# Altium project FMC_ADC_250M_16B_4ch.PrjPCB (part 2 of 4)

## Sheet ADC.SchDoc
size A3
Used 4 times, as channels U_ADC, U_ADC, U_ADC, U_ADC. Parts and nets are listed once, with the designators drawn on the sheet.
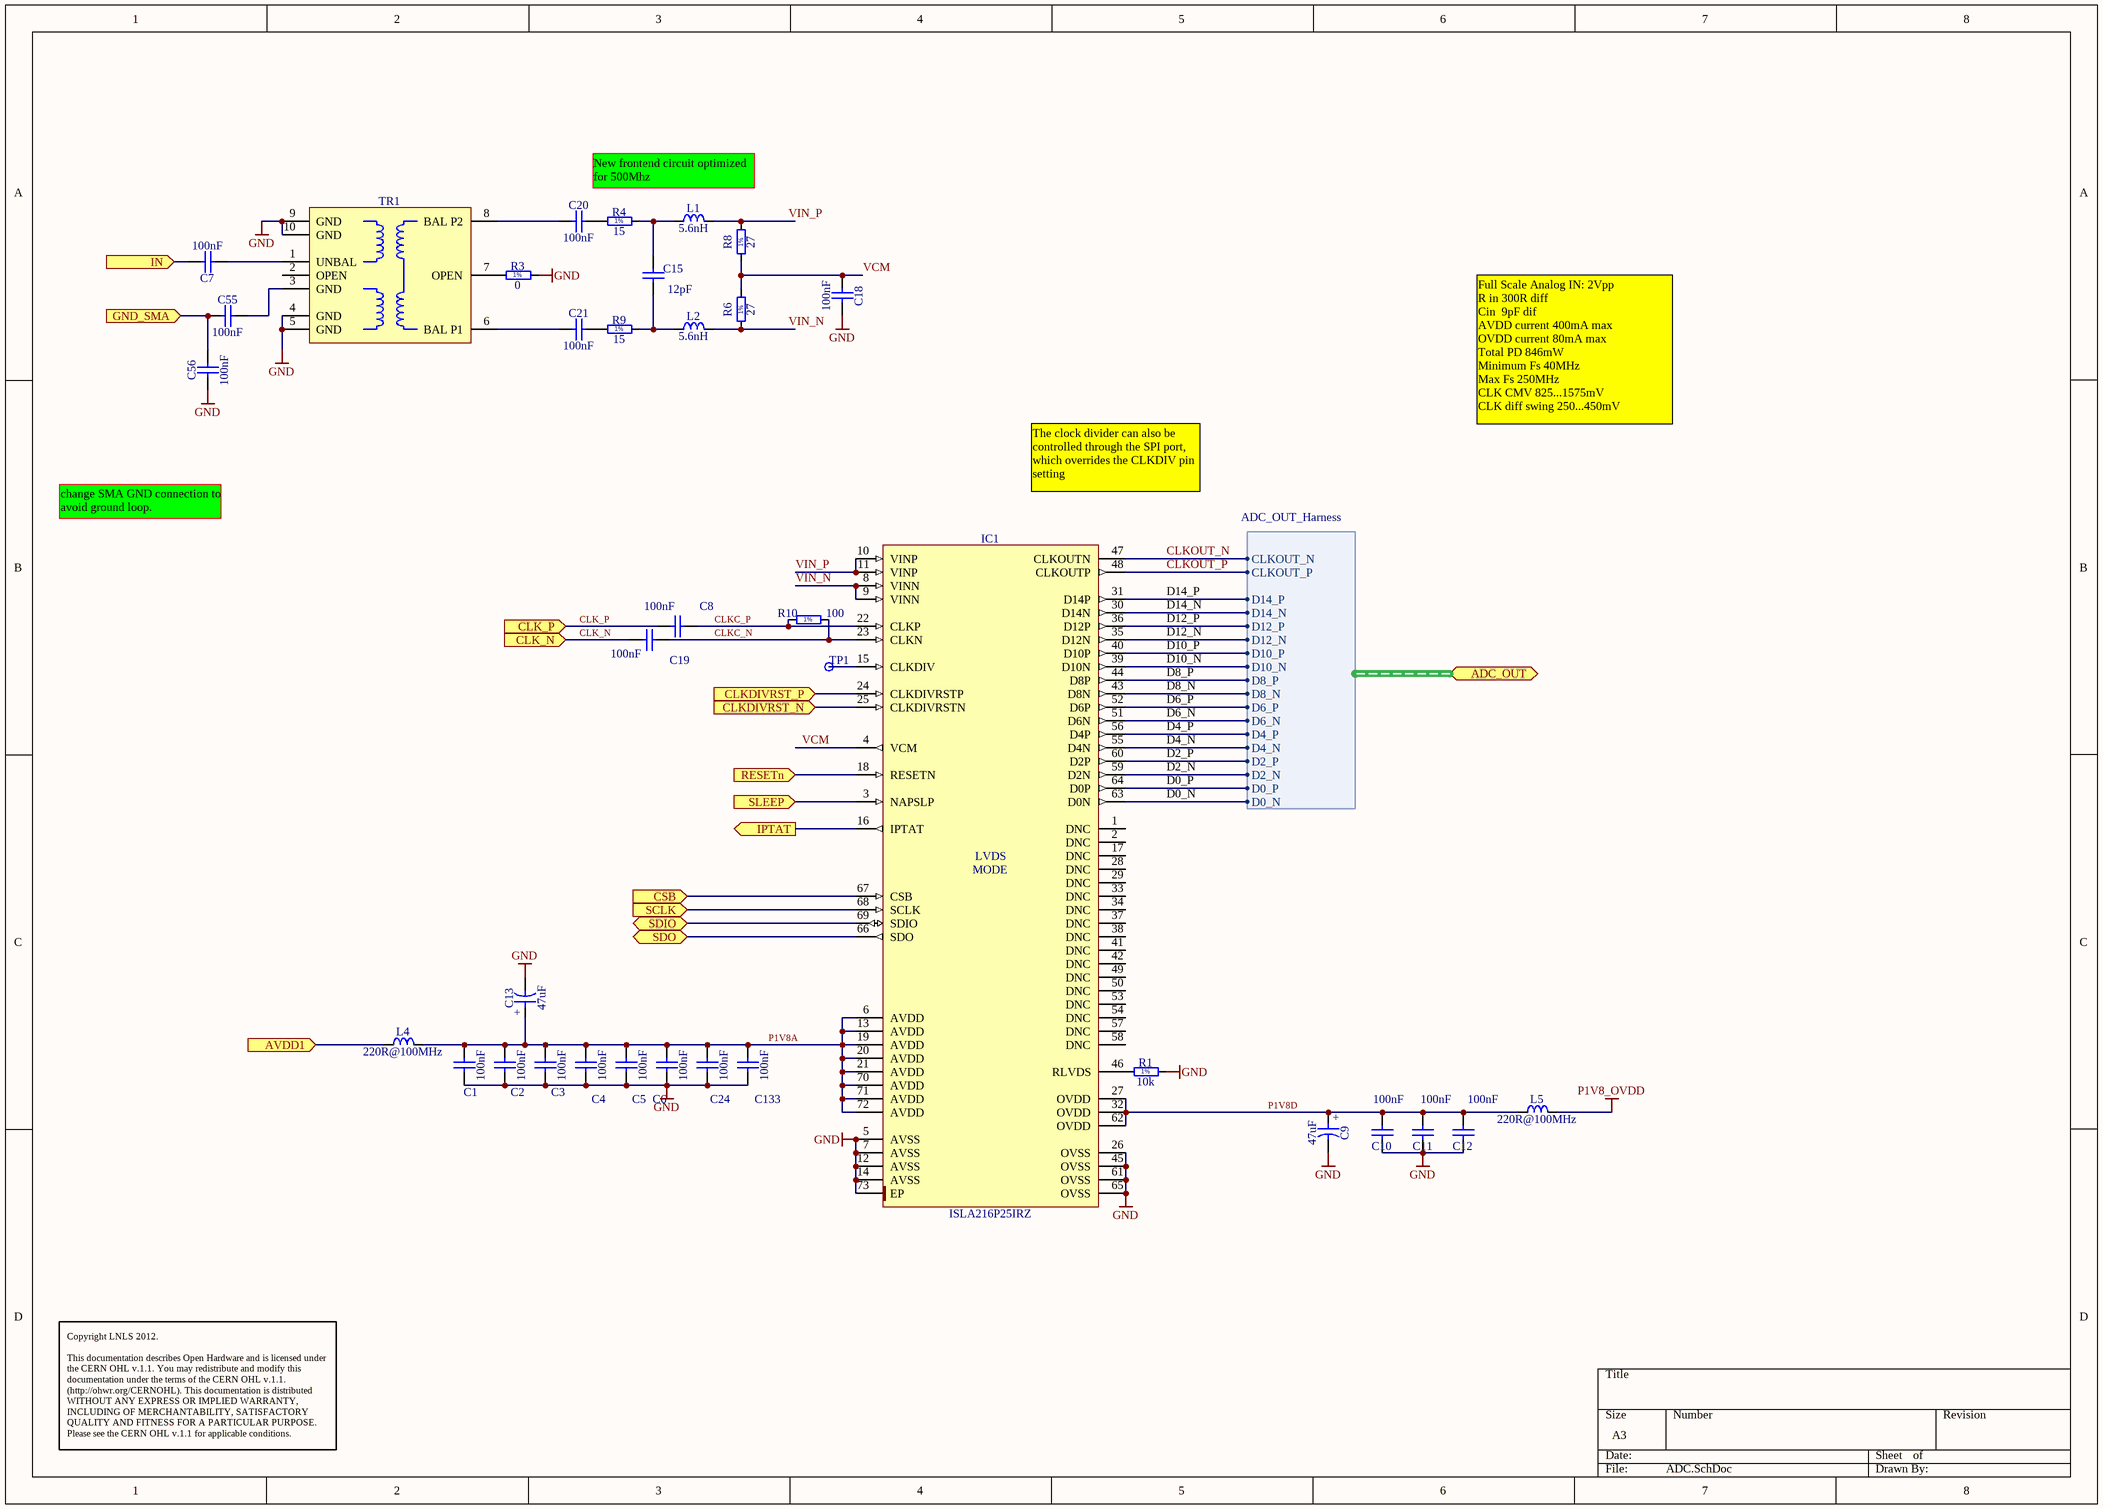
[diagram p3: ADC.SchDoc]

### Parts
C1  100nF  [CAPC0603X33N]
C2  100nF  [CAPC0603X33N]
C3  100nF  [CAPC0603X33N]
C4  100nF  [CAPC0603X33N]
C5  100nF  [CAPC0603X33N]
C6  100nF  [CAPC0603X33N]
C7  100nF  [CAPC0603X33N]
C8  100nF  [CAPC0603X33N]
C9  47uF  [CAPMP3528X210N]
C10  100nF  [CAPC0603X33N]
C11  100nF  [CAPC0603X33N]
C12  100nF  [CAPC0603X33N]
C13  47uF  [CAPMP3528X210N]
C15  12pF  [CAPC2012X135N]
C18  100nF  [CAPC0603X33N]
C19  100nF  [CAPC0603X33N]
C20  100nF  [CAPC0603X33N]
C21  100nF  [CAPC0603X33N]
C24  100nF  [CAPC0603X33N]
C55  100nF  [CAPC0603X33N]
C56  100nF  [CAPC0603X33N]
C133  100nF  [CAPC0603X33N]
IC1  ISLA216P25IRZ  [INTERSIL_L72.10x10E]
L1  5.6nH  [INDC1005X55N]
L2  5.6nH  [INDC1005X55N]
L4  220R@100MHz  [INDC2012X105N]
L5  220R@100MHz  [INDC2012X105N]
R1  10k  [RESC1005X40N]
R3  0  [RESC1005X40N]
R4  15  [RESC1005X40N]
R6  27  [RESC1005X40N]
R8  27  [RESC1005X40N]
R9  15  [RESC1005X40N]
R10  100  [RESC1005X40N]
TP1  (no value)  [TPR120]
TR1  (no value)  [XFMR_ANAREN_BD0205F5050A00]

### Ports
ADC_OUT (harness ADC_OUT_Harness), AVDD1 (in), CLK_N (in), CLK_P (in), CLKDIVRST_N (in), CLKDIVRST_P (in), CSB (in), GND_SMA (in), IN (in), IPTAT (out), RESETn (in), SCLK (in), SDIO (bidir), SDO, SLEEP (in)

### Harnesses
ADC_OUT_Harness: D14_P, D14_N, D12_P, D12_N, D10_P, D10_N, D8_P, D8_N, D6_P, D6_N, D4_P, D4_N, D2_P, D2_N, D0_P, D0_N, CLKOUT_N, CLKOUT_P

### Nets
GND: C1.1 C2.1 C3.1 C4.1 C5.1 C6.1 C9.2 C10.1 C11.1 C12.1 C13.2 C18.2 C24.1 C56.1 C133.1 IC1.5(AVSS) IC1.7(AVSS) IC1.12(AVSS) IC1.14(AVSS) IC1.26(OVSS) IC1.45(OVSS) IC1.61(OVSS) IC1.65(OVSS) IC1.73(EP) R1.2 R3.2 TR1.4(GND) TR1.5(GND) TR1.9(GND) TR1.10(GND)
P1V8_OVDD: L5.2
AVDD1: L4.1 ; port AVDD1
CLK_N: C19.1 ; port CLK_N
CLK_P: C8.1 ; port CLK_P
CLKC_N: C19.2 IC1.23(CLKN) R10.2
CLKC_P: C8.2 IC1.22(CLKP) R10.1
CLKDIVRST_N: IC1.25(CLKDIVRSTN) ; port CLKDIVRST_N
CLKDIVRST_P: IC1.24(CLKDIVRSTP) ; port CLKDIVRST_P
CLKOUT_N: IC1.47(CLKOUTN) ; port ADC_OUT.CLKOUT_N
CLKOUT_P: IC1.48(CLKOUTP) ; port ADC_OUT.CLKOUT_P
CSB: IC1.67(CSB) ; port CSB
D0_N: IC1.63(D0N) ; port ADC_OUT.D0_N
D0_P: IC1.64(D0P) ; port ADC_OUT.D0_P
D2_N: IC1.59(D2N) ; port ADC_OUT.D2_N
D2_P: IC1.60(D2P) ; port ADC_OUT.D2_P
D4_N: IC1.55(D4N) ; port ADC_OUT.D4_N
D4_P: IC1.56(D4P) ; port ADC_OUT.D4_P
D6_N: IC1.51(D6N) ; port ADC_OUT.D6_N
D6_P: IC1.52(D6P) ; port ADC_OUT.D6_P
D8_N: IC1.43(D8N) ; port ADC_OUT.D8_N
D8_P: IC1.44(D8P) ; port ADC_OUT.D8_P
D10_N: IC1.39(D10N) ; port ADC_OUT.D10_N
D10_P: IC1.40(D10P) ; port ADC_OUT.D10_P
D12_N: IC1.35(D12N) ; port ADC_OUT.D12_N
D12_P: IC1.36(D12P) ; port ADC_OUT.D12_P
D14_N: IC1.30(D14N) ; port ADC_OUT.D14_N
D14_P: IC1.31(D14P) ; port ADC_OUT.D14_P
GND_SMA: C55.1 C56.2 ; port GND_SMA
IN: C7.2 ; port IN
IPTAT: IC1.16(IPTAT) ; port IPTAT
P1V8A: C1.2 C2.2 C3.2 C4.2 C5.2 C6.2 C13.1 C24.2 C133.2 IC1.6(AVDD) IC1.13(AVDD) IC1.19(AVDD) IC1.20(AVDD) IC1.21(AVDD) IC1.70(AVDD) IC1.71(AVDD) IC1.72(AVDD) L4.2
P1V8D: C9.1 C10.2 C11.2 C12.2 IC1.27(OVDD) IC1.32(OVDD) IC1.62(OVDD) L5.1
RESETn: IC1.18(RESETN) ; port RESETn
SCLK: IC1.68(SCLK) ; port SCLK
SDIO: IC1.69(SDIO) ; port SDIO
SDO: IC1.66(SDO) ; port SDO
SLEEP: IC1.3(NAPSLP) ; port SLEEP
VCM: C18.1 IC1.4(VCM) R6.2 R8.1
VIN_N: IC1.8(VINN) IC1.9(VINN) L2.2 R6.1
VIN_P: IC1.10(VINP) IC1.11(VINP) L1.2 R8.2
NetC7_1: C7.1 TR1.1(UNBAL)
NetC15_1: C15.1 L2.1 R9.2
NetC15_2: C15.2 L1.1 R4.2
NetC20_1: C20.1 TR1.8(BAL_P2)
NetC20_2: C20.2 R4.1
NetC21_1: C21.1 TR1.6(BAL_P1)
NetC21_2: C21.2 R9.1
NetC55_2: C55.2 TR1.3(GND)
NetIC1_15: IC1.15(CLKDIV) TP1.1
NetIC1_46: IC1.46(RLVDS) R1.1
NetR3_1: R3.1 TR1.7(OPEN)

Not connected (* = marked no-connect by the designer): IC1 1(DNC) 2(DNC) 17(DNC) 28(DNC) 29(DNC) 33(DNC) 34(DNC) 37(DNC) 38(DNC) 41(DNC) 42(DNC) 49(DNC) 50(DNC) 53(DNC) 54(DNC) 57(DNC) 58(DNC); TR1 2(OPEN)

### Channels
U_ADC: designators end in A; ports AVDD1=P1V8_AVDD1 CLK_N=ADC1_CLK_N CLK_P=ADC1_CLK_P CLKDIVRST_N=CLKDIVRST_N CLKDIVRST_P=CLKDIVRST_P CSB=ADC_BUF_CSB0 GND_SMA=NetC55A_1 IN=IN1 IPTAT=IPTAT1 RESETn=ADC_BUF_RESETn SCLK=ADC_BUF_SCLK SDIO=ADC_BUF_SDI SDO=ADC_BUF_SDO SLEEP=ADC_BUF_SLEEP
U_ADC: designators end in B; ports AVDD1=P1V8_AVDD1 CLK_N=ADC2_CLK_N CLK_P=ADC2_CLK_P CLKDIVRST_N=CLKDIVRST_N CLKDIVRST_P=CLKDIVRST_P CSB=ADC_BUF_CSB1 GND_SMA=NetC55B_1 IN=IN2 IPTAT=IPTAT2 RESETn=ADC_BUF_RESETn SCLK=ADC_BUF_SCLK SDIO=ADC_BUF_SDI SDO=ADC_BUF_SDO SLEEP=ADC_BUF_SLEEP
U_ADC: designators end in C; ports AVDD1=P1V8_AVDD2 CLK_N=ADC3_CLK_N CLK_P=ADC3_CLK_P CLKDIVRST_N=CLKDIVRST_N CLKDIVRST_P=CLKDIVRST_P CSB=ADC_BUF_CSB2 GND_SMA=NetC55C_1 IN=IN3 IPTAT=IPTAT3 RESETn=ADC_BUF_RESETn SCLK=ADC_BUF_SCLK SDIO=ADC_BUF_SDI SDO=ADC_BUF_SDO SLEEP=ADC_BUF_SLEEP
U_ADC: designators end in D; ports AVDD1=P1V8_AVDD2 CLK_N=ADC4_CLK_N CLK_P=ADC4_CLK_P CLKDIVRST_N=CLKDIVRST_N CLKDIVRST_P=CLKDIVRST_P CSB=ADC_BUF_CSB3 GND_SMA=NetC55D_1 IN=IN4 IPTAT=IPTAT4 RESETn=ADC_BUF_RESETn SCLK=ADC_BUF_SCLK SDIO=ADC_BUF_SDI SDO=ADC_BUF_SDO SLEEP=ADC_BUF_SLEEP

### Notes on the sheet
- New frontend circuit optimized for 500Mhz
- Full Scale Analog IN:	2Vpp
  R in	300R diff
  Cin 	9pF dif
  AVDD current 400mA max
  OVDD current 80mA max
  Total PD 846mW
  Minimum Fs 40MHz
  Max Fs 250MHz
  CLK CMV 825...1575mV
  CLK diff swing 250...450mV
- change SMA GND connection to avoid ground loop.
- The clock divider can also be controlled through the SPI port,
  which overrides the CLKDIV pin setting
- Copyright LNLS 2012.
  This documentation describes Open Hardware and is licensed under the CERN OHL v.1.1. You may redistribute and modify this documentation under the terms of the CERN OHL v.1.1. (http://ohwr.org/CERNOHL). This documentation is distributed WITHOUT ANY EXPRESS OR IMPLIED WARRANTY, INCLUDING OF MERCHANTABILITY, SATISFACTORY QUALITY AND FITNESS FOR A PARTICULAR PURPOSE. Please see the CERN OHL v.1.1 for applicable conditions.
- (in symbol CTE3528-21_47UF_6.3V_10%_LESR0250) +
- (in symbol ISLA216P25IRZ) LVDS; MODE
- (in symbol R0402_0R_JUMPER) 1%
- (in symbol R0402_10K_1%_0.0625W_100PPM) 1%
- (in symbol R0402_15R_1%_0.0625W_100PPM) 1%
- (in symbol R0402_27R_1%_0.0625W_100PPM) 1%
- (in symbol R0402_100R_1%_0.0625W_100PPM) 1%

### Library data of the parts
C1-C8 C10-C12 C18-C21 C24 C55 C56 C133 = CC0201_100NF_6.3V_10%_X5R: Non-polarised capacitor; Part Description: SMD Multilayer Chip Ceramic Capacitor; Manufacturer: GENERIC; Manufacturer1 Part Number: 02016D104KAT2A; Voltage: 6.3V; TC: X5R; Tolerance: ±10%; Table: Capacitors SMD; Part Number: CC0201_100NF_6.3V_10%_X5R; Component Kind: Standard; Component Type: Standard; Pin Count: 2; Value: 100nF; Status: Not Recommended; Manufacturer Part Number: CC0201_100NF_6.3V_10%_X5R; Case: 0201; Mounted: Yes; Socket: No; SMD: Yes; Manufacturer1 Example: AVX; Manufacturer1 ComponentHeight: 0.33mm; HelpURL: \\cern.ch\dfs\Applications\Altium\Datasheets\CC0201_X5R_AVX.pdf; Author: CERN DEM JLC; CreateDate: 03/12/2007; LatestRevisionDate: 03/12/2007; Sense: No
C9 C13 = CTE3528-21_47UF_6.3V_10%_LESR0250: Polarised capacitor; Part Description: Low ESR 0R25 Solid Tantalum Chip Capacitor; Manufacturer: GENERIC; Manufacturer1 Part Number: TPSB476K006R0250; Voltage: 6.3V; Tolerance: ±10%; Table: Capacitors SMD; Part Number: CTE3528-21_47UF_6.3V_10%_LESR0250; Component Kind: Standard; Component Type: Standard; Pin Count: 2; Value: 47uF; Status: Preferred; Manufacturer Part Number: CTE3528-21_47UF_6.3V_10%_LESR0250; Case: B; Mounted: Yes; Socket: No; SMD: Yes; Manufacturer1 Example: AVX; Manufacturer1 ComponentHeight: 2.1mm; HelpURL: \\cern.ch\dfs\Applications\Altium\Datasheets\CTE-LESR_AVX_TPS.pdf; Author: CERN DEM JLC; CreateDate: 05/05/2008; LatestRevisionDate: 20/01/2009; Sense: No
C15 = CC0805_12PF_50V_5%_NP0: Non-polarised capacitor; Part Description: SMD Multilayer Chip Ceramic Capacitor; Manufacturer: GENERIC; Manufacturer1 Part Number: 223886115129; Voltage: 50V; TC: C0G/NP0; Tolerance: ±5%; Part Number: CC0805_12PF_50V_5%_NP0; Component Kind: Standard; Component Type: Standard; Pin Count: 2; Value: 12pF; Status: Preferred; Manufacturer Part Number: CC0805_12PF_50V_5%_NP0; Case: 0805; Mounted: Yes; Socket: No; SMD: Yes; Manufacturer1 Example: PHYCOMP; Manufacturer1 ComponentHeight: 1.35mm; HelpURL: \\cern.ch\dfs\Applications\Altium\Datasheets\CC0805_NP0_PHYCOMP.pdf; Author: CERN DEM JLC; CreateDate: 03/12/2007; LatestRevisionDate: 03/12/2007; Sense: No
IC1 = ISLA216P25IRZ: 16-Bit, 250MSPS ADC (LVDS Mode); Manufacturer: INTERSIL; Table: Analog & Interface; Bonding: No; PressFit: No; Part Number: ISLA216P25IRZ; Component Kind: Standard; Component Type: Standard; Device: ISLA216P25IRZ; PackageDescription: INTERSIL Case Style L72.10x10E, QFN, 0.50mm Pitch, Square; 72 Pin, 10.00mm L X 10.00mm W X 1.00mm H body (w/ Thermal Tab 7.15 X 6mm); Part Description: 16-Bit, 250MSPS ADC; Manufacturer Part Number: ISLA216P25IRZ; Pin Count: 16; Case: QFN72; Mounted: Yes; Socket: No; SMD: Yes; ComponentHeight: 0.9mm; Author: CERN DEM JLC; HelpURL: \\cern.ch\dfs\Applications\Altium\Datasheets\ISLA216P25IRZ.pdf; CreateDate: 18/09/2012; LatestRevisionDate: 18/09/2012; Sense: No
L1 = IND0402_5.6nH_0.3n_JOHANSON_L-07C5N6SV6T: Inductor; Part Description: RF Ceramic Chip Inductor; Power: 300mA; Resistance: 0.270R; Tolerance: ±0.3nH; Part Number: IND0402_5.6nH_0.3n_JOHANSON_L-07C5N6SV6T; Component Kind: Standard; Component Type: Standard; Pin Count: 2; Value: 5.6nH; Status: None; Manufacturer: JOHANSON; Manufacturer Part Number: L-07C5N6SV6T; Mounted: YES; Socket: No; SMD: Yes; ComponentHeight: 0.3mm; Author: LNLS DIG GBMB; CreateDate: 01/06/2016; LatestRevisionDate: 01/06/2016; Sense: No; Case: 0402
L2 = IND0402_5.6nH_0.3n_JOHANSON_L-07C5N6SV6T: Inductor; Part Description: RF Ceramic Chip Inductor; Power: 300mA; Tolerance: ±0.3nH; Resistance: 0.270R; Part Number: IND0402_5.6nH_0.3n_JOHANSON_L-07C5N6SV6T; Component Kind: Standard; Component Type: Standard; Pin Count: 2; Value: 5.6nH; Status: None; Manufacturer: JOHANSON; Manufacturer Part Number: L-07C5N6SV6T; Case: 0402; Mounted: YES; Socket: No; SMD: Yes; ComponentHeight: 0.3mm; Author: LNLS DIG GBMB; CreateDate: 01/06/2016; LatestRevisionDate: 01/06/2016; Sense: No
L4 L5 = IND0805_MURATA_BLM21PG221SN1D: Inductor; Part Description: SMD EMIFIL Suppression Chip Ferrite Bead; Manufacturer: MURATA; Power: 2A; Resistance: 0.05R; Tolerance: ±25%; Table: Inductors SMD; Part Number: IND0805_MURATA_BLM21PG221SN1D; Component Kind: Standard; Component Type: Standard; Pin Count: 2; Value: 220R@100MHz; Status: None; Manufacturer Part Number: BLM21PG221SN1D; Case: 0805; Mounted: Yes; Socket: No; SMD: Yes; ComponentHeight: 1.05mm; HelpURL: \\cern.ch\dfs\Applications\Altium\Datasheets\IND0402_MURATA_BLM21P.pdf; Author: CERN DEM JLC; CreateDate: 25/01/2010; LatestRevisionDate: 25/01/2010; Sense: No
R1 = R0402_10K_1%_0.0625W_100PPM: Resistor - 1%; Part Description: General Purpose Thick Film Chip Resistor; Manufacturer: GENERIC; Manufacturer1 Part Number: 232270671003L; TC: ±100ppm/°C; Table: Resistors SMD; Part Number: R0402_10K_1%_0.0625W_100PPM; Component Kind: Standard; Component Type: Standard; Pin Count: 2; Value: 10k; Status: Not recommended; Power: 0.0625W; Tolerance: ±1%; Manufacturer Part Number: R0402_10K_1%_0.0625W_100PPM; Case: 0402; Mounted: Yes; Socket: No; SMD: Yes; Manufacturer1 Example: YAGEO PHYCOMP; Manufacturer1 ComponentHeight: 0.4mm; HelpURL: \\cern.ch\dfs\Applications\Altium\Datasheets\R0402_Phycomp_RC0402.pdf; Author: CERN DEM JLC; CreateDate: 03/12/2007; LatestRevisionDate: 17/10/2012; Sense: No
R3 = R0402_0R_JUMPER: Resistor - 1%; Part Description: 1A (0.05R Max DC Resistance) Zero Ohm Jumper; Manufacturer: GENERIC; Manufacturer1 Part Number: 232270591001L; Table: Resistors SMD; Part Number: R0402_0R_JUMPER; Component Kind: Standard; Component Type: Standard; Pin Count: 2; Value: 0; Status: Not recommended; Manufacturer Part Number: R0402_0R_JUMPER; Case: 0402; Mounted: Yes; Socket: No; SMD: Yes; Manufacturer1 Example: YAGEO PHYCOMP; Manufacturer1 ComponentHeight: 0.4mm; HelpURL: \\cern.ch\dfs\Applications\Altium\Datasheets\R0402_Phycomp_RC0402.pdf; Author: CERN DEM JLC; CreateDate: 03/12/2007; LatestRevisionDate: 17/10/2012; Sense: No
R4 R9 = R0402_15R_1%_0.0625W_100PPM: Resistor - 1%; Part Number: CRCW04026R98FKED; Part Description: General Purpose Thick Film Chip Resistor; Manufacturer: GENERIC; Manufacturer1 Part Number: 232270671509L; TC: ±100ppm/°C; Table: Resistors SMD; Component Kind: Standard; Component Type: Standard; Pin Count: 2; Value: 15; Status: Not recommended; Power: 0.0625W; Tolerance: ±1%; Manufacturer Part Number: R0402_15R_1%_0.0625W_100PPM; Case: 0402; Mounted: Yes; Socket: No; SMD: Yes; Manufacturer1 Example: YAGEO PHYCOMP; Manufacturer1 ComponentHeight: 0.4mm; HelpURL: \\cern.ch\dfs\Applications\Altium\Datasheets\R0402_Phycomp_RC0402.pdf; Author: CERN DEM JLC; CreateDate: 03/12/2007; LatestRevisionDate: 17/10/2012; Sense: No
R6 R8 = R0402_27R_1%_0.0625W_100PPM: Resistor - 1%; Part Number: RC0402FR-0720RL; Part Description: General Purpose Thick Film Chip Resistor; Manufacturer: GENERIC; Manufacturer1 Part Number: 232270672709L; TC: ±100ppm/°C; Table: Resistors SMD; Component Kind: Standard; Component Type: Standard; Pin Count: 2; Value: 27; Status: Not recommended; Power: 0.0625W; Tolerance: ±1%; Manufacturer Part Number: R0402_27R_1%_0.0625W_100PPM; Case: 0402; Mounted: Yes; Socket: No; SMD: Yes; Manufacturer1 Example: YAGEO PHYCOMP; Manufacturer1 ComponentHeight: 0.4mm; HelpURL: \\cern.ch\dfs\Applications\Altium\Datasheets\R0402_Phycomp_RC0402.pdf; Author: CERN DEM JLC; CreateDate: 03/12/2007; LatestRevisionDate: 17/10/2012; Sense: No
R10 = R0402_100R_1%_0.0625W_100PPM: Resistor - 1%; Part Description: General Purpose Thick Film Chip Resistor; Manufacturer: GENERIC; Manufacturer1 Part Number: 232270671001L; TC: ±100ppm/°C; Table: Resistors SMD; Part Number: R0402_100R_1%_0.0625W_100PPM; Component Kind: Standard; Component Type: Standard; Pin Count: 2; Value: 100; Status: Not recommended; Power: 0.0625W; Tolerance: ±1%; Manufacturer Part Number: R0402_100R_1%_0.0625W_100PPM; Case: 0402; Mounted: Yes; Socket: No; SMD: Yes; Manufacturer1 Example: YAGEO PHYCOMP; Manufacturer1 ComponentHeight: 0.4mm; HelpURL: \\cern.ch\dfs\Applications\Altium\Datasheets\R0402_Phycomp_RC0402.pdf; Author: CERN DEM JLC; CreateDate: 03/12/2007; LatestRevisionDate: 17/10/2012; Sense: No
TP1 = SMD_PAD_1.20_d_MM: Test Point; Part Description: 1.20mm diameter SMD Test Point Area; Mounted: No; Part Number: SMD_PAD_1.20_d_MM; Component Kind: Standard (No BOM); Component Type: Standard (No BOM); Pin Count: 1; Family: Test Point; Socket: No; SMD: Yes; Sense: No; Status: None; ComponentHeight: 0mm; HelpURL: Undefined; Author: LNLS DIG GBMB; CreateDate: 31/05/2016; LatestRevisionDate: 31/05/2016; PackageDescription: 1.20mm diameter SMD Test Point Area
TR1 = XFMR_ANAREN_BD0205F5050A00: 70MHz - 1000MHz Ultra Low Profile Sub-Miniature Balanced to Unbalanced Transformer; Manufacturer: ANAREN; Table: Transformers; Part Number: XFMR_ANAREN_BD0205F5050A00; Component Kind: Standard; Component Type: Standard; Pin Count: 10; Status: None; Part Description: 70MHz - 1000MHz Ultra Low Profile Sub-Miniature Balanced to Unbalanced Transformer; Manufacturer Part Number: BD0205F5050A00; Mounted: Yes; Socket: No; SMD: Yes; ComponentHeight: 2.60.91; HelpURL: \\cern.ch\dfs\Applications\Altium\Datasheets\XFMR_ANAREN_BD0205F5050A00.pdf; Author: CERN DEM JLC; CreateDate: 03/10/2012; LatestRevisionDate: 03/10/2012; Sense: No

## Sheet Supply.SchDoc
size A3
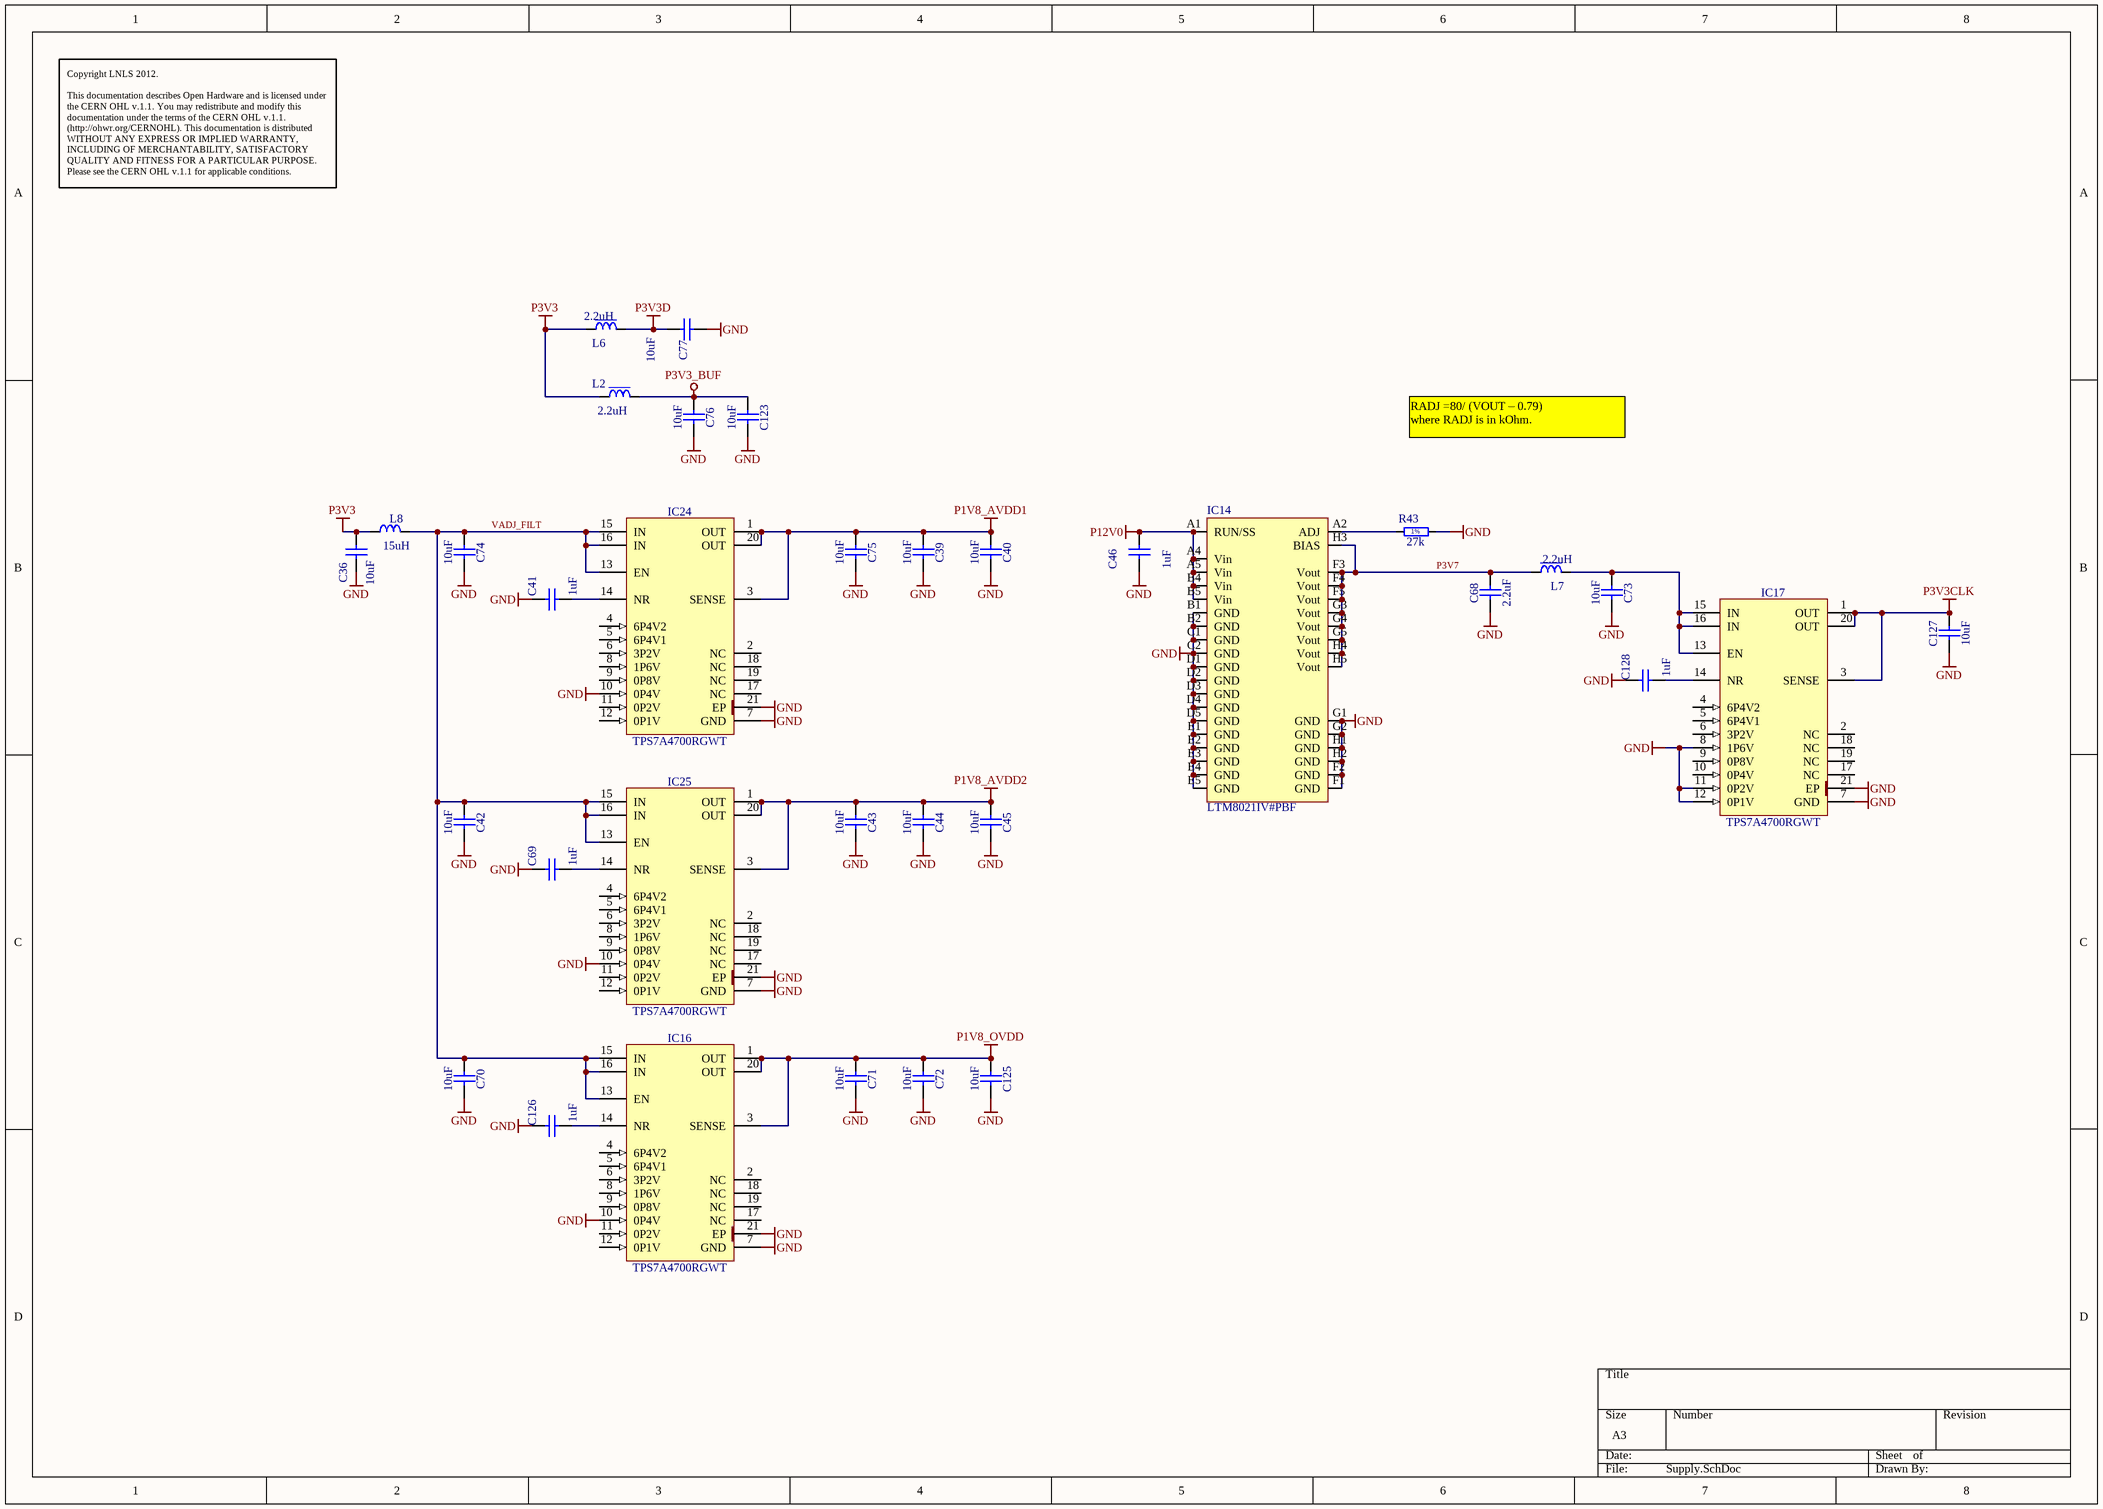
[diagram p4: Supply.SchDoc]

### Parts
C36  10uF  [CAPC2012X135N]
C39  10uF  [CAPC2012X135N]
C40  10uF  [CAPC2012X135N]
C41  1uF  [CAPC1608X87N]
C42  10uF  [CAPC2012X135N]
C43  10uF  [CAPC2012X135N]
C44  10uF  [CAPC2012X135N]
C45  10uF  [CAPC2012X135N]
C46  1uF  [CAPC1608X87N]
C68  2.2uF  [CAPC2012X135N]
C69  1uF  [CAPC1608X87N]
C70  10uF  [CAPC2012X135N]
C71  10uF  [CAPC2012X135N]
C72  10uF  [CAPC2012X135N]
C73  10uF  [CAPC2012X135N]
C74  10uF  [CAPC2012X135N]
C75  10uF  [CAPC2012X135N]
C76  10uF  [CAPC2012X135N]
C77  10uF  [CAPC2012X135N]
C123  10uF  [CAPC2012X135N]
C125  10uF  [CAPC2012X135N]
C126  1uF  [CAPC1608X87N]
C127  10uF  [CAPC2012X135N]
C128  1uF  [CAPC1608X87N]
IC14  LTM8021IV#PBF  [LGA35S127P5X8]
IC16  TPS7A4700RGWT  [QFN65P500X500X100-21N-S325]
IC17  TPS7A4700RGWT  [QFN65P500X500X100-21N-S325]
IC24  TPS7A4700RGWT  [QFN65P500X500X100-21N-S325]
IC25  TPS7A4700RGWT  [QFN65P500X500X100-21N-S325]
L2  2.2uH  [IND_PANASONIC_ELLVGG]
L6  2.2uH  [IND_PANASONIC_ELLVGG]
L7  2.2uH  [IND_PANASONIC_ELLVGG]
L8  15uH  [IND_TDK_VLCF4020-1]
R43  27k  [RESC1608X55N]

### Nets
GND: C36.2 C39.2 C40.2 C41.2 C42.2 C43.2 C44.2 C45.2 C46.2 C68.1 C69.2 C70.2 C71.2 C72.2 C73.2 C74.2 C75.2 C76.2 C77.2 C123.2 C125.2 C126.2 C127.1 C128.2 IC14.B1(GND) IC14.B2(GND) IC14.C1(GND) IC14.C2(GND) IC14.D1(GND) IC14.D2(GND) IC14.D3(GND) IC14.D4(GND) IC14.D5(GND) IC14.E1(GND) IC14.E2(GND) IC14.E3(GND) IC14.E4(GND) IC14.E5(GND) IC14.F1(GND) IC14.F2(GND) IC14.G1(GND) IC14.G2(GND) IC14.H1(GND) IC14.H2(GND) IC16.7(GND) IC16.10(0P4V) IC16.21(EP) IC17.7(GND) IC17.8(1P6V) IC17.11(0P2V) IC17.12(0P1V) IC17.21(EP) IC24.7(GND) IC24.10(0P4V) IC24.21(EP) IC25.7(GND) IC25.10(0P4V) IC25.21(EP) R43.2
P1V8_AVDD1: C39.1 C40.1 C75.1 IC24.1(OUT) IC24.3(SENSE) IC24.20(OUT)
P1V8_AVDD2: C43.1 C44.1 C45.1 IC25.1(OUT) IC25.3(SENSE) IC25.20(OUT)
P1V8_OVDD: C71.1 C72.1 C125.1 IC16.1(OUT) IC16.3(SENSE) IC16.20(OUT)
P3V3: C36.1 L2.1 L6.1 L8.1
P3V3_BUF: C76.1 C123.1 L2.2
P3V3CLK: C127.2 IC17.1(OUT) IC17.3(SENSE) IC17.20(OUT)
P3V3D: C77.1 L6.2
P12V0: C46.1 IC14.A1(RUN/SS) IC14.A4(Vin) IC14.A5(Vin) IC14.B4(Vin) IC14.B5(Vin)
P3V7: C68.2 IC14.F3(Vout) IC14.F4(Vout) IC14.F5(Vout) IC14.G3(Vout) IC14.G4(Vout) IC14.G5(Vout) IC14.H3(BIAS) IC14.H4(Vout) IC14.H5(Vout) L7.1
VADJ_FILT: C42.1 C70.1 C74.1 IC16.13(EN) IC16.15(IN) IC16.16(IN) IC24.13(EN) IC24.15(IN) IC24.16(IN) IC25.13(EN) IC25.15(IN) IC25.16(IN) L8.2
NetC41_1: C41.1 IC24.14(NR)
NetC69_1: C69.1 IC25.14(NR)
NetC73_1: C73.1 IC17.13(EN) IC17.15(IN) IC17.16(IN) L7.2
NetC126_1: C126.1 IC16.14(NR)
NetC128_1: C128.1 IC17.14(NR)
NetIC14_A2: IC14.A2(ADJ) R43.1

Not connected (* = marked no-connect by the designer): IC16 2(NC) 4(6P4V2) 5(6P4V1) 6(3P2V) 8(1P6V) 9(0P8V) 11(0P2V) 12(0P1V) 17(NC) 18(NC) 19(NC); IC17 2(NC) 4(6P4V2) 5(6P4V1) 6(3P2V) 9(0P8V) 10(0P4V) 17(NC) 18(NC) 19(NC); IC24 2(NC) 4(6P4V2) 5(6P4V1) 6(3P2V) 8(1P6V) 9(0P8V) 11(0P2V) 12(0P1V) 17(NC) 18(NC) 19(NC); IC25 2(NC) 4(6P4V2) 5(6P4V1) 6(3P2V) 8(1P6V) 9(0P8V) 11(0P2V) 12(0P1V) 17(NC) 18(NC) 19(NC)

### Notes on the sheet
- Copyright LNLS 2012.
  This documentation describes Open Hardware and is licensed under the CERN OHL v.1.1. You may redistribute and modify this documentation under the terms of the CERN OHL v.1.1. (http://ohwr.org/CERNOHL). This documentation is distributed WITHOUT ANY EXPRESS OR IMPLIED WARRANTY, INCLUDING OF MERCHANTABILITY, SATISFACTORY QUALITY AND FITNESS FOR A PARTICULAR PURPOSE. Please see the CERN OHL v.1.1 for applicable conditions.
- RADJ =80/ (VOUT – 0.79)
  where RADJ is in kOhm.
- (in symbol R0603_27K_1%_0.1W_100PPM) 1%

### Library data of the parts
C36 C39 C40 C42-C45 C70-C77 C123 C125 C127 = CC0805_10UF_16V_10%_X5R: Non-polarised capacitor; Part Description: SMD Multilayer Chip Ceramic Capacitor; Manufacturer: GENERIC; Manufacturer1 Part Number: C0805C106K4PAC; Voltage: 16V; TC: X5R; Tolerance: ±10%; Part Number: CC0805_10UF_16V_10%_X5R; Component Kind: Standard; Component Type: Standard; Pin Count: 2; Value: 10uF; Status: Preferred; Manufacturer Part Number: CC0805_10UF_16V_10%_X5R; Case: 0805; Mounted: Yes; Socket: No; SMD: Yes; Sense: No; Manufacturer1 Example: KEMET; Manufacturer1 ComponentHeight: 1.4mm; HelpURL: \\cern.ch\dfs\Applications\Altium\Datasheets\CC1206_X5R_KEMET.pdf; Author: CERN DEM JLC; CreateDate: 03/12/2007; LatestRevisionDate: 03/12/2007
C41 C46 C69 C126 C128 = CC0603_1UF_16V_10%_X7R: Non-polarised capacitor; Part Description: SMD Multilayer Chip Ceramic Capacitor; Manufacturer: GENERIC; Manufacturer1 Part Number: 223878615663; Voltage: 16V; TC: X7R; Tolerance: ±10%; Part Number: CC0603_1UF_16V_10%_X7R; Component Kind: Standard; Component Type: Standard; Pin Count: 2; Value: 1uF; Status: None; Manufacturer Part Number: CC0603_1uF_16V_10%_X7R; Case: 0603; Mounted: Yes; Socket: No; SMD: Yes; Sense: No; Manufacturer1 Example: YAGEO PHYCOMP; Manufacturer1 ComponentHeight: 0.9mm; HelpURL: \\cern.ch\dfs\Applications\Altium\Datasheets\CC0603_X7R_PHYCOMP.pdf; Author: CERN DEM JLC; CreateDate: 03/12/2007; LatestRevisionDate: 17/04/2015
C68 = CC0805_2.2UF_16V_10%_X7R: Non-polarised capacitor; Part Description: SMD Multilayer Chip Ceramic Capacitor; Manufacturer: GENERIC; Manufacturer1 Part Number: GRM21BF51C225ZA01L; Voltage: 16V; TC: X7R; Tolerance: ±10%; Part Number: CC0805_2.2UF_16V_10%_X7R; Component Kind: Standard; Component Type: Standard; Pin Count: 2; Value: 2.2uF; Status: Preferred; Manufacturer Part Number: CC0805_2.2UF_16V_10%_X7R; Case: 0805; Mounted: Yes; Socket: No; SMD: Yes; Sense: No; Manufacturer1 Example: MURATA; Manufacturer1 ComponentHeight: 1.5mm; HelpURL: \\cern.ch\dfs\Applications\Altium\Datasheets\CC0805_X7R_MURATA_GRM.pdf; Author: CERN DEM JLC; CreateDate: 03/12/2007; LatestRevisionDate: 18/09/2014
IC14 = LTM8021IV#PBF: 36VIN, 500mA  Step-Down DC/DC Module; Manufacturer: LINEAR TECHNOLOGY; PressFit: No; Bonding: No; Part Number: LTM8021IV#PBF; Component Kind: Standard; Component Type: Standard; Device: LTM8021IV#PBF; Footprint: LGA35S127P5X8_625x1125x292; PackageDescription: LGA, 1.27mm pitch,rect.; 35 pin,5 columns X 8 rows, 6.25mm X 11.25mm X 2.92mm H; Part Description: 36VIN, 500mA  Step-Down DC/DC Module; Manufacturer Part Number: LTM8021IV#PBF; Pin Count: 35; Mounted: Yes; Socket: No; SMD: Yes; Sense: No; ComponentHeight: 2.92mm; Author: LNLS DIG GBMB; CreateDate: 28/05/2016; LatestRevisionDate: 28/05/2016
IC16 IC17 IC24 IC25 = TPS7A4700RGWT: Low Noise (3uVrms), 1A, High Voltage Low-Dropout Linear Regulator; Part Description: 1.4 V to 19.1 V, 1A, Low Noise (3uVrms), Low-Dropout Linear Regulator; Manufacturer: TEXAS INSTRUMENTS; Table: Regulators; Bonding: No; PressFit: No; Part Number: TPS7A4700RGWT; Component Kind: Standard; Component Type: Standard; Device: TPS7A4700RGWT; PackageDescription: QFN, 0.65mm pitch,square; 20 pin, 5mm X 5mm X 1mm H body (w/thermal tab 3.25 X 3.25mm),  IPC Medium Density; Manufacturer Part Number: TPS7A4700RGWT; Pin Count: 21; Case: QFN20; Mounted: Yes; Socket: No; SMD: Yes; ComponentHeight: 1mm; HelpURL: \\cern.ch\dfs\Applications\Altium\Datasheets\TPS7A4700RGWT.pdf; Author: CERN DEM JLC; CreateDate: 03/07/2012; LatestRevisionDate: 03/07/2012; Sense: No
L2 L6 L7 = IND_2.2UH_30%_PANASONIC_ELLVGG2R2N: Inductor With Core; Part Description: Wire Wound SMD Power Inductor, G Series; Power: 1.4A; Resistance: 0.087R; Tolerance: ±30%; Part Number: IND_2.2UH_30%_PANASONIC_ELLVGG2R2N; Component Kind: Standard; Component Type: Standard; Pin Count: 2; Value: 2.2uH; Status: None; Manufacturer: PANASONIC; Manufacturer Part Number: ELLVGG2R2N; Mounted: Yes; Socket: No; SMD: Yes; Sense: No; ComponentHeight: 1.5mm; HelpURL: \\cern.ch\dfs\Applications\Altium\Datasheets\IND_PANASONIC_ELLVGG.pdf; Author: LNLS DIG GBMB; CreateDate: 31/05/2016; LatestRevisionDate: 31/05/2016
L8 = IND_15UH_20%_TDK_VLCF4020-1: Inductor; Part Description: SMD Inductor for Power Circuits (Wound/STD , Magnetic Shielded), VLCF series; Manufacturer: TDK; Manufacturer Part Number: VLCF4020T-150MR68; Power: 0.68A; Resistance: 0.275; Tolerance: ±20%; Part Number: IND_15UH_20%_TDK_VLCF4020-1; Component Kind: Standard; Component Type: Standard; Pin Count: 2; Value: 15uH; Status: None; Mounted: Yes; Socket: No; SMD: Yes; Sense: No; ComponentHeight: 2mm; Author: LNLS DIG GBMB; CreateDate: 31/05/2016; LatestRevisionDate: 31/05/216
R43 = R0603_27K_1%_0.1W_100PPM: Resistor - 1%; Part Description: General Purpose Thick Film Chip Resistor; Manufacturer: GENERIC; Manufacturer1 Part Number: NRC06F2702TRF; Power: 0.1W; TC: ±100ppm/°C; Part Number: R0603_27K_1%_0.1W_100PPM; Component Kind: Standard; Component Type: Standard; Pin Count: 2; Value: 27k; Status: Preferred; Tolerance: ±1%; Manufacturer Part Number: R0603_27K_1%_0.1W_100PPM; Case: 0603; Mounted: Yes; Sense: No; Socket: No; SMD: Yes; Manufacturer1 Example: NIC COMPONENT; Manufacturer1 ComponentHeight: 0.55mm; HelpURL: \\cern.ch\dfs\Applications\Altium\Datasheets\R0603_NIC_NRC.pdf; Author: CERN DEM JLC; CreateDate: 03/12/2007; LatestRevisionDate: 13/03/2008